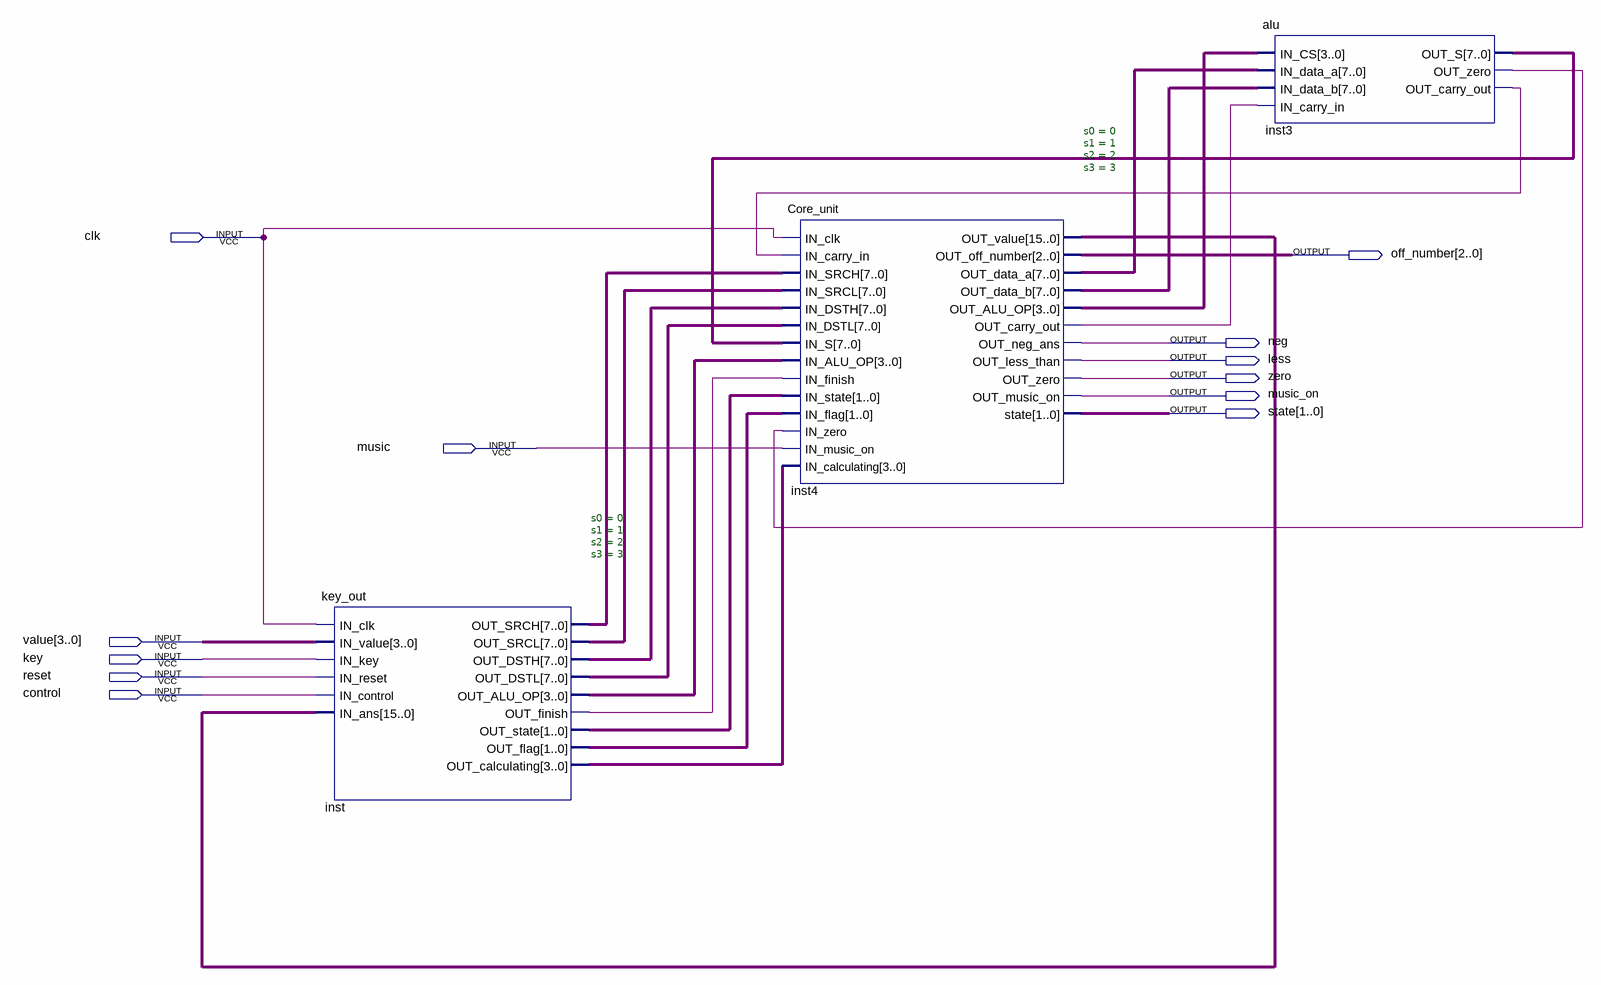
[diagram p0: schematic sheet]
// Quartus schematic debug.bdf as structural Verilog: 3 symbols, 12 pins
module debug (
  input  clk,
  input  music,
  input  [3:0] value,
  input  key,
  input  reset,
  input  control,
  output [2:0] off_number,
  output neg,
  output less,
  output zero,
  output music_on,
  output [1:0] state
);

  wire inst3_out_carry_out, inst3_out_zero, inst4_out_carry_out, inst_out_finish;
  wire [1:0] inst_out_flag, inst_out_state;
  wire [3:0] inst4_out_alu_op, inst_out_alu_op, inst_out_calculating;
  wire [7:0] inst3_out_s, inst4_out_data_a, inst4_out_data_b, inst_out_dsth, inst_out_dstl, inst_out_srch,
       inst_out_srcl;
  wire [15:0] inst4_out_value;

  key_out #(.s0(0), .s1(1), .s2(2), .s3(3)) inst (
    .IN_clk(clk), .IN_value(value), .IN_key(key), .IN_reset(reset), .IN_control(control),
    .IN_ans(inst4_out_value), .OUT_SRCH(inst_out_srch), .OUT_SRCL(inst_out_srcl), .OUT_DSTH(inst_out_dsth),
    .OUT_DSTL(inst_out_dstl), .OUT_ALU_OP(inst_out_alu_op), .OUT_finish(inst_out_finish),
    .OUT_state(inst_out_state), .OUT_flag(inst_out_flag), .OUT_calculating(inst_out_calculating));
  Core_unit #(.s0(0), .s1(1), .s2(2), .s3(3)) inst4 (
    .IN_clk(clk), .IN_carry_in(inst3_out_carry_out), .IN_SRCH(inst_out_srch), .IN_SRCL(inst_out_srcl),
    .IN_DSTH(inst_out_dsth), .IN_DSTL(inst_out_dstl), .IN_S(inst3_out_s), .IN_ALU_OP(inst_out_alu_op),
    .IN_finish(inst_out_finish), .IN_state(inst_out_state), .IN_flag(inst_out_flag),
    .IN_zero(inst3_out_zero), .IN_music_on(music), .IN_calculating(inst_out_calculating),
    .OUT_value(inst4_out_value), .OUT_off_number(off_number), .OUT_data_a(inst4_out_data_a),
    .OUT_data_b(inst4_out_data_b), .OUT_ALU_OP(inst4_out_alu_op), .OUT_carry_out(inst4_out_carry_out),
    .OUT_neg_ans(neg), .OUT_less_than(less), .OUT_zero(zero), .OUT_music_on(music_on), .state(state));
  alu inst3 (
    .IN_CS(inst4_out_alu_op), .IN_data_a(inst4_out_data_a), .IN_data_b(inst4_out_data_b),
    .IN_carry_in(inst4_out_carry_out), .OUT_S(inst3_out_s), .OUT_zero(inst3_out_zero),
    .OUT_carry_out(inst3_out_carry_out));
endmodule
